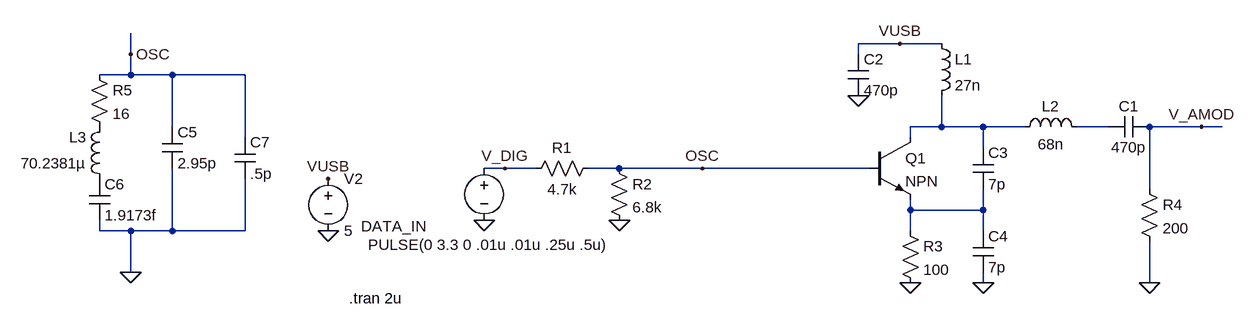
[diagram p0: schematic OOK_mod.asc]
OOK_mod.asc, the LTspice schematic file:
Version 4
SHEET 1 1004 680
WIRE 464 208 400 208
WIRE 528 208 464 208
WIRE -720 224 -720 192
WIRE 400 224 400 208
WIRE -720 256 -720 224
WIRE -720 256 -768 256
WIRE -656 256 -720 256
WIRE -544 256 -656 256
WIRE -656 336 -656 256
WIRE 528 336 528 288
WIRE 528 336 480 336
WIRE 592 336 528 336
WIRE 656 336 592 336
WIRE 784 336 736 336
WIRE 928 336 848 336
WIRE 960 336 928 336
WIRE -544 352 -544 256
WIRE 480 352 480 336
WIRE 592 368 592 336
WIRE -144 400 -176 400
WIRE -96 400 -144 400
WIRE 32 400 -16 400
WIRE 160 400 32 400
WIRE 416 400 160 400
WIRE 848 432 848 336
WIRE 480 464 480 448
WIRE 592 464 592 432
WIRE 592 464 480 464
WIRE -768 496 -768 480
WIRE -720 496 -768 496
WIRE -656 496 -656 400
WIRE -656 496 -720 496
WIRE -544 496 -544 416
WIRE -544 496 -656 496
WIRE 480 496 480 464
WIRE 592 496 592 464
WIRE -720 560 -720 496
WIRE 592 576 592 560
WIRE 848 576 848 512
FLAG 32 480 0
FLAG -176 480 0
FLAG 480 576 0
FLAG 592 576 0
FLAG 400 288 0
FLAG 848 576 0
FLAG -416 496 0
FLAG -416 416 VUSB
FLAG 464 208 VUSB
FLAG -720 560 0
FLAG -720 224 OSC
FLAG 160 400 OSC
FLAG -144 400 V_DIG
FLAG 928 336 V_AMOD
SYMBOL npn2 416 352 R0
SYMATTR InstName Q1
SYMBOL res 0 384 R90
WINDOW 0 0 56 VBottom 2
WINDOW 3 32 56 VTop 2
SYMATTR InstName R1
SYMATTR Value 4.7k
SYMBOL res 16 384 R0
SYMATTR InstName R2
SYMATTR Value 6.8k
SYMBOL res 464 480 R0
SYMATTR InstName R3
SYMATTR Value 100
SYMBOL res 832 416 R0
SYMATTR InstName R4
SYMATTR Value 200
SYMBOL cap 848 320 R90
WINDOW 0 0 32 VBottom 2
WINDOW 3 32 32 VTop 2
SYMATTR InstName C1
SYMATTR Value 470p
SYMBOL cap 384 224 R0
SYMATTR InstName C2
SYMATTR Value 470p
SYMBOL cap 576 368 R0
SYMATTR InstName C3
SYMATTR Value 7p
SYMBOL cap 576 496 R0
SYMATTR InstName C4
SYMATTR Value 7p
SYMBOL ind 512 192 R0
SYMATTR InstName L1
SYMATTR Value 27n
SYMBOL ind 640 352 R270
WINDOW 0 32 56 VTop 2
WINDOW 3 5 56 VBottom 2
SYMATTR InstName L2
SYMATTR Value 68n
SYMBOL voltage -176 384 R0
WINDOW 0 -88 105 Right 2
WINDOW 3 -179 133 Left 2
WINDOW 123 0 0 Left 2
WINDOW 39 0 0 Left 2
SYMATTR InstName DATA_IN
SYMATTR Value PULSE(0 3.3 0 .01u .01u .25u .5u)
SYMBOL voltage -416 400 R0
WINDOW 123 0 0 Left 2
WINDOW 39 0 0 Left 2
SYMATTR InstName V2
SYMATTR Value 5
SYMBOL res -784 240 R0
SYMATTR InstName R5
SYMATTR Value 16
SYMBOL ind -752 432 R180
WINDOW 0 36 80 Left 2
WINDOW 3 36 40 Left 2
SYMATTR InstName L3
SYMATTR Value 70.2381µ
SYMBOL cap -672 336 R0
SYMATTR InstName C5
SYMATTR Value 2.95p
SYMBOL cap -784 416 R0
SYMATTR InstName C6
SYMATTR Value 1.9173f
SYMBOL cap -560 352 R0
SYMATTR InstName C7
SYMATTR Value .5p
TEXT -384 600 Left 2 !.tran 2u

The netlist it stands for:
* OOK_mod.asc
Q1 N001 OSC N003 0 NPN
R1 OSC V_DIG 4.7k
R2 OSC 0 6.8k
R3 N003 0 100
R4 V_AMOD 0 200
C1 V_AMOD N002 470p
C2 VUSB 0 470p
C3 N001 N003 7p
C4 N003 0 7p
L1 VUSB N001 27n
L2 N001 N002 68n
V§DATA_IN V_DIG 0 PULSE(0 3.3 0 .01u .01u .25u .5u)
V2 VUSB 0 5
R5 OSC P001 16
L3 P002 P001 70.2381µ
C5 OSC 0 2.95p
C6 P002 0 1.9173f
C7 OSC 0 .5p
.model NPN NPN
.model PNP PNP
.lib standard.bjt
.tran 2u
.backanno
.end